# EAGLE design pc2_key (EAGLE 6.4)
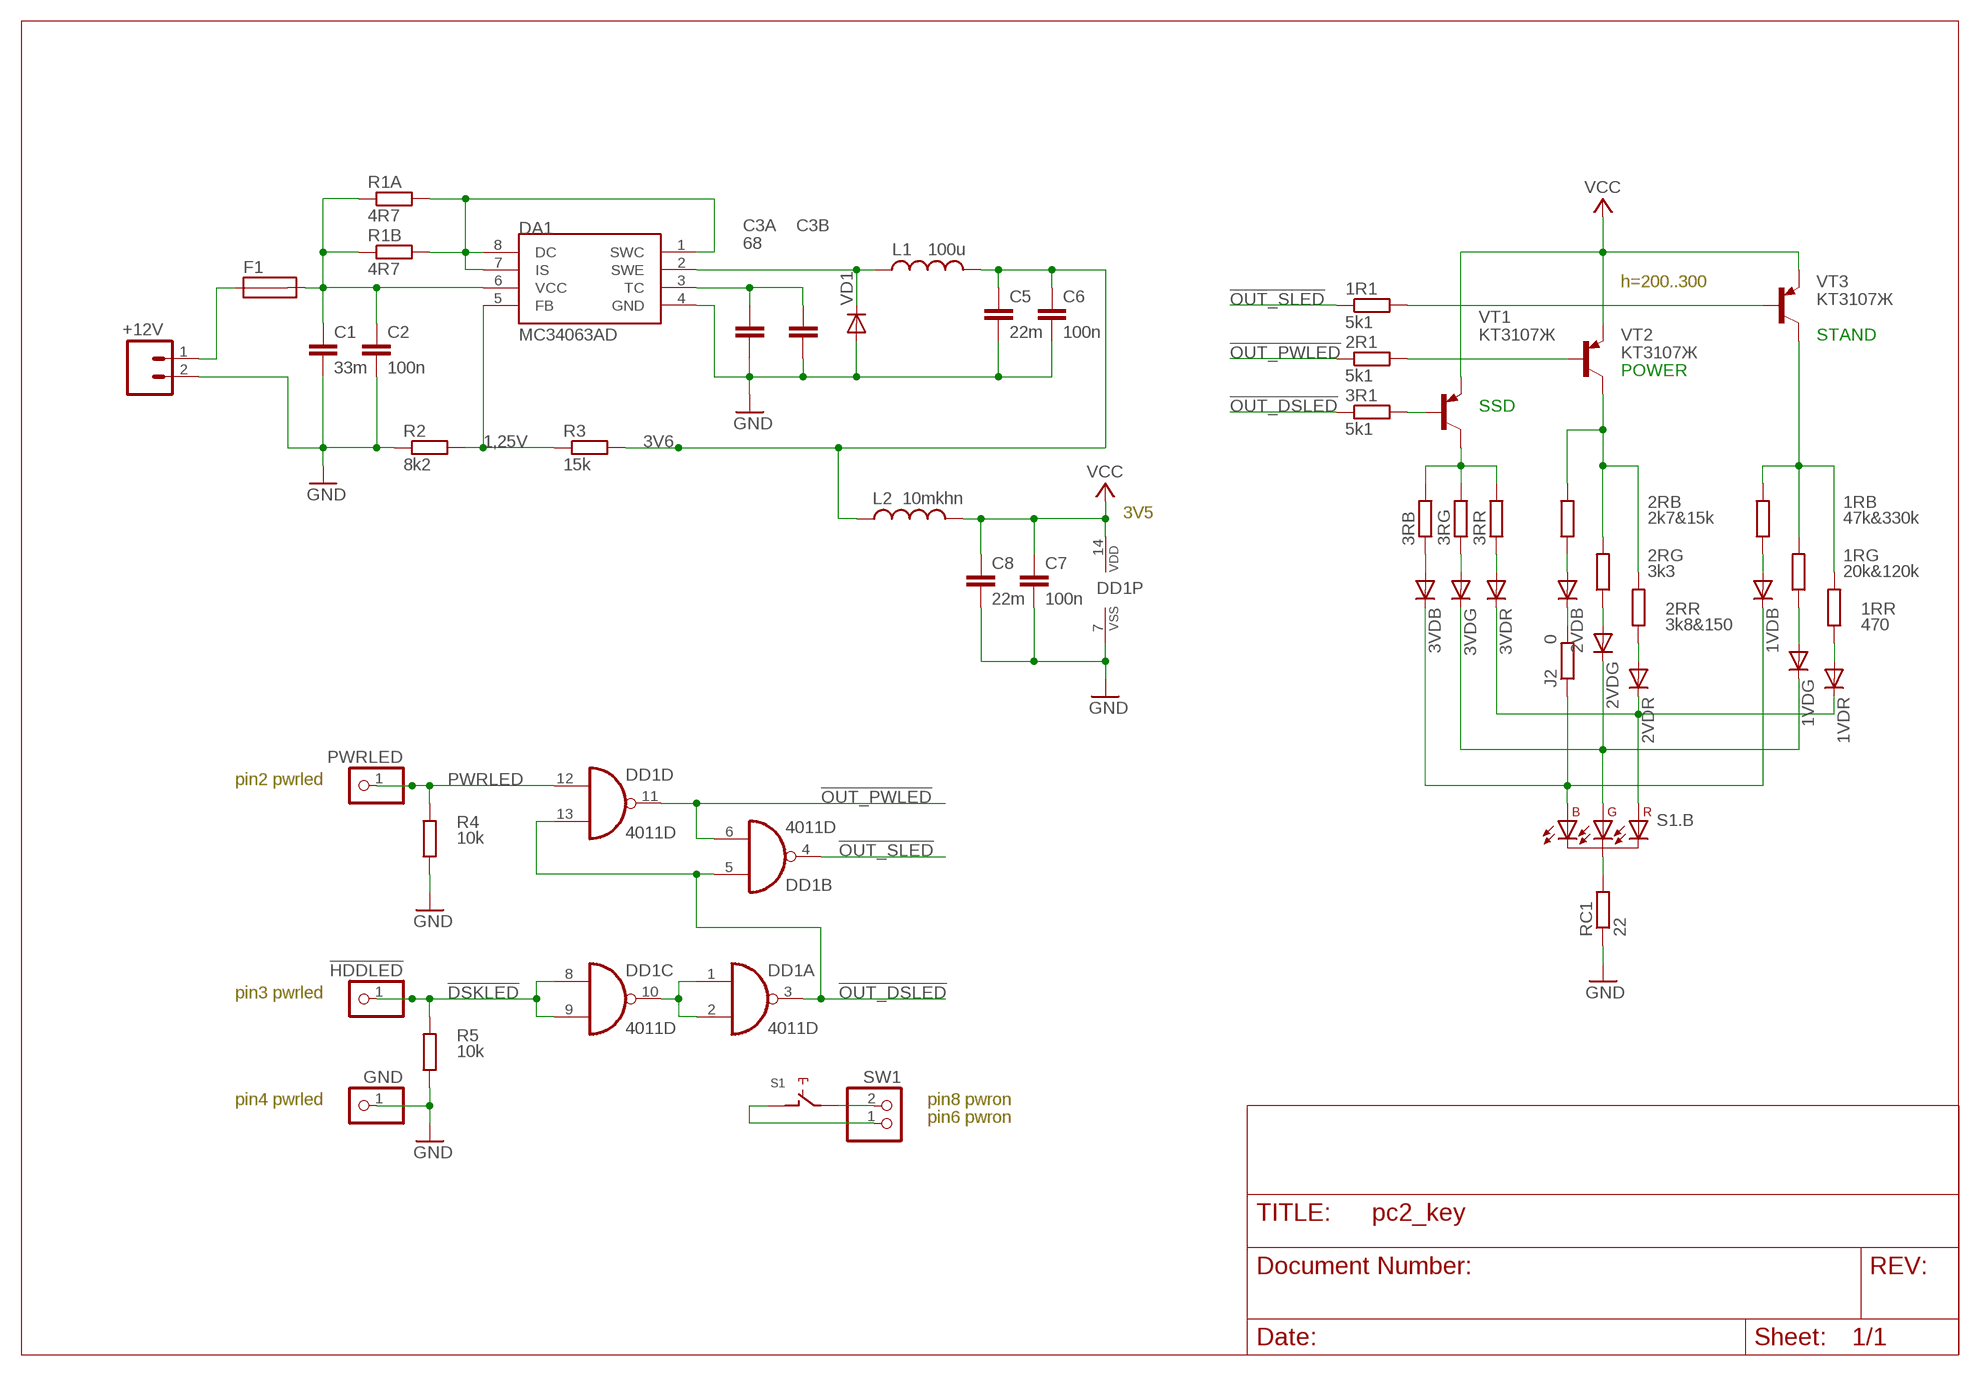
[diagram p0: schematic, sheet 1]

## Parts
1R1  5k1  R-EU_R1206W  [R1206W]
1RB  47k&330k  R-EU_R0805  [R0805]
1RG  20k&120k  R-EU_R0805  [R0805]
1RR  470  R-EU_R0805  [R0805]
1VDB  DIODE-SOD80C  [SOD80C]
1VDG  DIODE-SOD80C  [SOD80C]
1VDR  DIODE-SOD80C  [SOD80C]
2R1  5k1  R-EU_R1206W  [R1206W]
2RB  2k7&15k  R-EU_R0805  [R0805]
2RG  3k3  R-EU_R0805  [R0805]
2RR  3k8&150  R-EU_R0805  [R0805]
2VDB  DIODE-SOD80C  [SOD80C]
2VDG  DIODE-SOD80C  [SOD80C]
2VDR  DIODE-SOD80C  [SOD80C]
3R1  5k1  R-EU_R1206W  [R1206W]
3RB  R-EU_R0805  [R0805]
3RG  R-EU_R0805  [R0805]
3RR  R-EU_R0805  [R0805]
3VDB  DIODE-SOD80C  [SOD80C]
3VDG  DIODE-SOD80C  [SOD80C]
3VDR  DIODE-SOD80C  [SOD80C]
!HDDLED  PINHD-1X1  [1X01]
+12V  CON_2P  [CON_PWR_2PIN4MM]
C1  33m  C-EUC1210  [C1210]
C2  100n  C-EUC0805K  [C0805K]
C3A  68  C-EUC0805K  [C0805K]
C3B  C-EUC0805K  [C0805K]
C5  22m  C-EUC1210  [C1210]
C6  100n  C-EUC0805K  [C0805K]
C7  100n  C-EUC0805K  [C0805K]
C8  22m  C-EUC1210  [C1210]
DA1  MC34063AD  [SOIC8]
DD1  4011D  [SO14]
F1  SH32  [SH32]
GND  PINHD-1X1  [1X01]
J2  0  R-EU_R1206W  [R1206W]
L1  100u  L_LH7X10MM  [LH7X10MM]
L2  10mkhn  L-USPIS2816  [PIS2816]
PWRLED  PINHD-1X1  [1X01]
R1A  4R7  R-EU_R1206  [R1206]
R1B  4R7  R-EU_R1206  [R1206]
R2  8k2  R-EU_R0805  [R0805]
R3  15k  R-EU_R0805  [R0805]
R4  10k  R-EU_M0805  [M0805]
R5  10k  R-EU_R1206W  [R1206W]
RC1  22  R-EU_R0805  [R0805]
S1  CHERRY-MX  [CHERRY-MX-4P]
SW1  PINHD-1X2  [1X02]
VD1  DIODE-SMB  [SMB]
VT1  KT3107Ж  BJT_PNP_TO-92_EBC  [TO92]
VT2  KT3107Ж  BJT_PNP_TO-92_EBC  [TO92]
VT3  KT3107Ж  BJT_PNP_TO-92_EBC  [TO92]

## Nets
1,25V: DA1.5(FB) R2.2 R3.1
3V6: C5.1 C6.1 L1.1 L2.1 R3.2
!DSKLED: !HDDLED.1 DD1.8(C:I0) DD1.9(C:I1) R5.2
!OUT_DSLED: 3R1.1 DD1.3(A:O) DD1.5(B:I0) DD1.13(D:I1)
!OUT_PWLED: 2R1.1 DD1.6(B:I1) DD1.11(D:O)
!OUT_SLED: 1R1.1 DD1.4(B:O)
B: 1VDB.C 3VDB.C J2.1 S1.D1(.B:B)
G: 1VDG.C 2VDG.C 3VDG.C S1.D2(.B:G)
GND: +12V.2 C1.2 C2.2 C3A.2 C3B.2 C5.2 C6.2 C7.2 C8.2 DA1.4(GND) DD1.7(P:VSS) GND.1 R2.1 R4.1 R5.1 RC1.1 VD1.A
N$3: DA1.1(SWC) DA1.7(IS) DA1.8(DC) R1A.2 R1B.2
N$5: C3A.1 C3B.1 DA1.3(TC)
N$6: 1RR.1 1VDR.A
N$7: 1RG.1 1VDG.A
N$8: 1RB.1 1VDB.A
N$9: 3R1.2 VT1.2(B)
N$10: 2R1.2 VT2.2(B)
N$11: 2RB.1 2VDB.A
N$12: 1R1.2 VT3.2(B)
N$15: 2RR.1 2VDR.A
N$16: 2RG.1 2VDG.A
N$17: 3RR.1 3VDR.A
N$18: 3RG.1 3VDG.A
N$19: DA1.2(SWE) L1.2 VD1.C
N$20: 3RB.1 3VDB.A
N$21: S1.SW2(.A:SW2) SW1.1
N$22: S1.SW1(.A:SW1) SW1.2
N$23: RC1.2 S1.D3(.B:RGB-)
N$24: 2VDB.C J2.2
N$26: 3RB.2 3RG.2 3RR.2 VT1.3(C)
N$27: 2RB.2 2RG.2 2RR.2 VT2.3(C)
N$28: 1RB.2 1RG.2 1RR.2 VT3.3(C)
N$29: DD1.1(A:I0) DD1.2(A:I1) DD1.10(C:O)
N$30: C1.1 C2.1 DA1.6(VCC) F1.P$2(2A) R1A.1 R1B.1
N$33: +12V.1 F1.P$1(1A)
PWRLED: DD1.12(D:I0) PWRLED.1 R4.2
R: 1VDR.C 2VDR.C 3VDR.C S1.D4(.B:R)
VCC: C7.1 C8.1 DD1.14(P:VDD) L2.2 VT1.1(E) VT2.1(E) VT3.1(E)

## Notes on the sheet
- h=200..300
- STAND
- POWER
- SSD
- 3V5
- pin2 pwrled
- pin3 pwrled
- pin4 pwrled | pin8 pwron
- pin6 pwron

## Library data of the parts
1R1 1RB 1RG 1RR 2R1 2RB 2RG 2RR 3R1 3RB 3RG 3RR J2 R4 R5 RC1 = rcl:R-EU_: RESISTOR, European symbol
1VDB 1VDG 1VDR 2VDB 2VDG 2VDR 3VDB 3VDG 3VDR VD1 = diode:DIODE-: DIODE
!HDDLED GND PWRLED = pinhead:PINHD-1X1: PIN HEADER
+12V = DSS:CON_2P
C1 C5 C8 = rcl:C-EU: CAPACITOR, European symbol
C2 C3A C3B C6 C7 = resistor:C-EU: CAPACITOR, European symbol
DA1 = mc34063:MC34063
DD1 = 40xx:4011: Quad 2-input NAND
F1 = fuse:SH32: FUSE HOLDER 6 x 32 mm, SH contact, SHH3N Schukat, 102071 Wickmann (Buerklin); MPN: 10207101009; OC_FARNELL: 811786; OC_NEWARK: 76R6904
L1 = ct-pack:L_: INDUCTOR, American symbol
L2 = rcl:L-US: INDUCTOR, American symbol
R1A R1B R2 R3 = resistor:R-EU_: RESISTOR, European symbol
S1 = gateronrgb:CHERRY-MX: Cherry MX series keyswitch
SW1 = pinhead:PINHD-1X2: PIN HEADER
VT1-VT3 = m_transistor:BJT_PNP: PNP Transistror КТ3107* CBE BD138 ECB

## Board
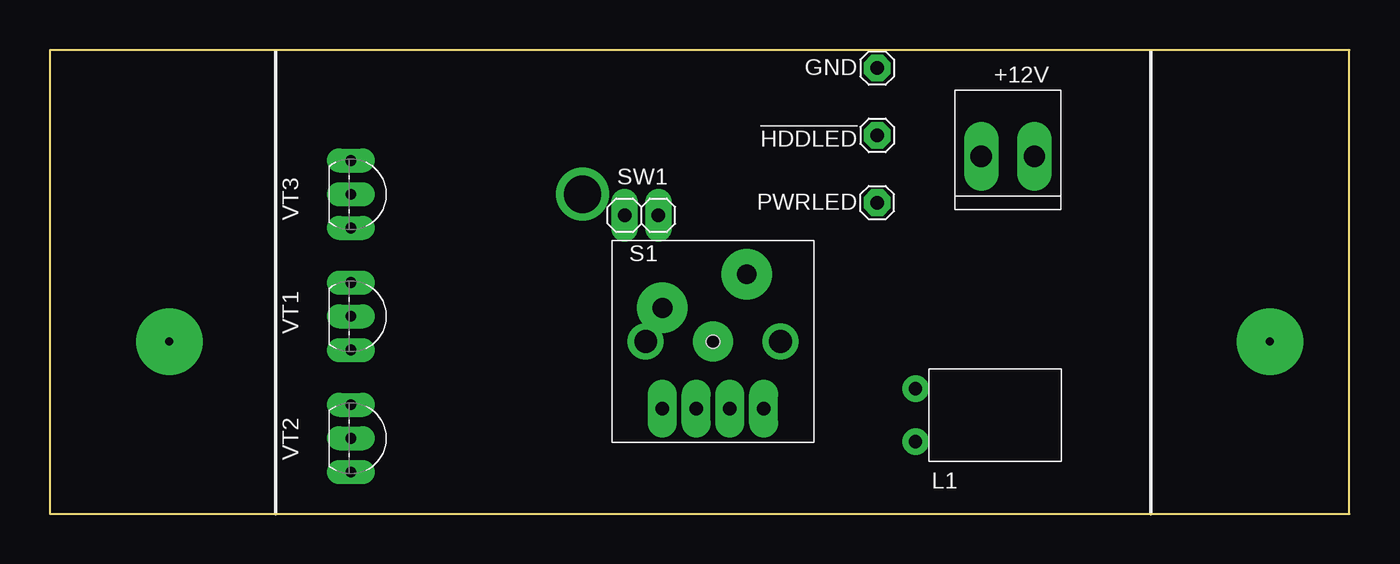
[diagram p1: board, top side]
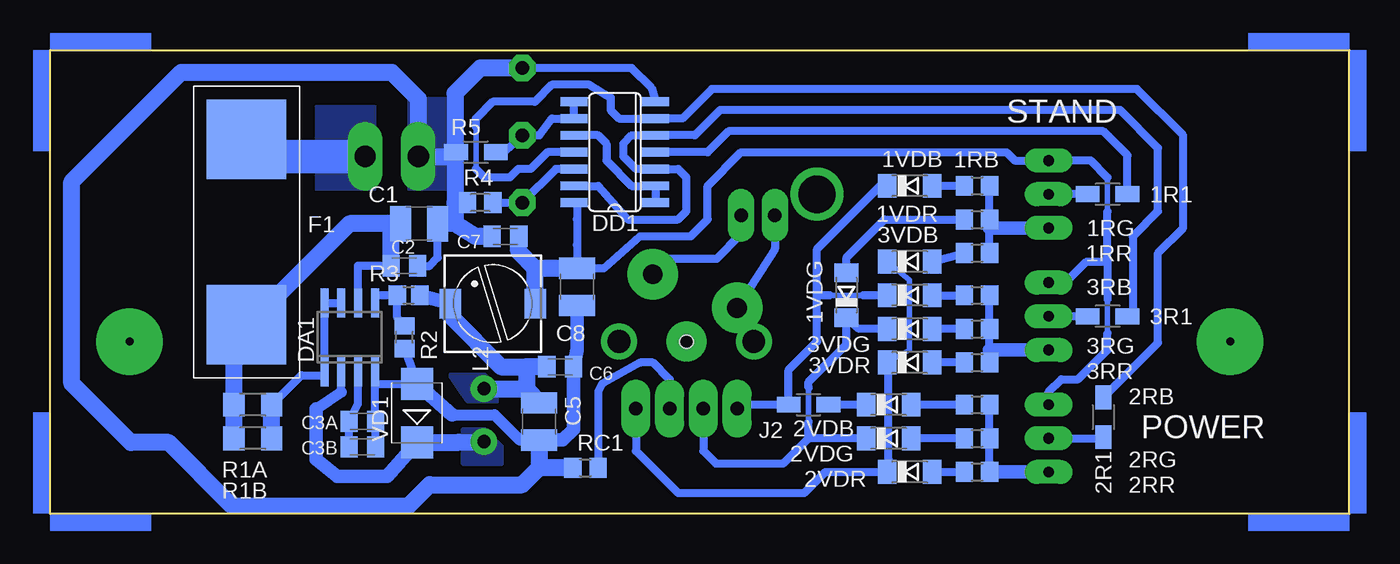
[diagram p2: board, bottom side, seen from below]

Size 98 x 35 mm. Coordinates in mm from the lower left corner, seen from the top.
Outline: 98,35 0,35 0,0 98,0 98,35
Copper layers (1*16): Top 0.035mm / dielectric 1.5mm / Bottom 0.035mm
Design rules "DesignRules": minimum track width 8mil, minimum drill 24mil, track to track 0.2mm, track to pad 0.2mm, pad to pad 8mil, via to via 8mil, smd to smd 8mil, copper to edge 10mil, drill to drill 8mil, minimum pad ring 0.5mm, minimum via ring 8mil, stop-mask expansion 4mil, vias tented up to drill 0mil, thermal gap 10mil

### Footprints (pad centres in the part's own frame; a part is rotated, then mirrored left to right if it is on the bottom)
R1206W = smd 1.8 x 1.2: 1 -1.499,0; 2 1.499,0
R0805 = smd 1.3 x 1.5: 1 -0.95,0; 2 0.95,0
SOD80C = smd 1.4 x 1.8: A 1.7,0; C -1.7,0
1X01 = drill 1.016 octagon: 1 0,0
CON_PWR_2PIN4MM = drill 1.6 long: 1 -2,0; 2 2,0
C1210 = smd 1.6 x 2.7: 1 -1.4,0; 2 1.4,0
C0805K = smd 1.3 x 1.6: 1 -1,0; 2 1,0
SOIC8 = smd 0.6 x 2.2: 1 -1.905,-2.6; 2 -0.635,-2.6; 3 0.635,-2.6; 4 1.905,-2.6; 5 1.905,2.6; 6 0.635,2.6; 7 -0.635,2.6; 8 -1.905,2.6
SO14 = smd 0.66 x 2.032: 1 -3.81,-3.073; 2 -2.54,-3.073; 3 -1.27,-3.073; 4 0,-3.073; 5 1.27,-3.073; 6 2.54,-3.073; 7 3.81,-3.073; 8 3.81,3.073; 9 2.54,3.073; 10 1.27,3.073; 11 0,3.073; 12 -1.27,3.073; 13 -2.54,3.073; 14 -3.81,3.073
SH32 = smd 6 x 6: P$1 -7,0; P$2 7,0
LH7X10MM = drill 1: 1 -2,-6; 2 2,-6
PIS2816 = smd 2.2 x 1.6: 1 0,3.2; 2 0,-3.2
R1206 = smd 1.6 x 1.803: 1 -1.422,0; 2 1.422,0
R0805' = smd 1.3 x 1.5: 1 -0.85,0; 2 0.85,0
M0805 = smd 1.3 x 1.6: 1 -0.95,0; 2 0.95,0
CHERRY-MX-4P = drill 1.016 pad 2.184 long: D1 -3.81,-5.08; D2 -1.27,-5.08; D3 1.27,-5.08; D4 3.81,-5.08 | drill 1 pad 3: P$1 0,0 | drill 1.714 pad 1.93: P$3 -5.08,0; P$4 5.08,0 | drill 1.5 pad 3.81: SW1 -3.81,2.54; SW2 2.54,5.08 | hole 1: 0,0
1X02 = drill 1.016 long: 1 -1.27,0; 2 1.27,0
SMB = smd 2.4 x 2.4: A 2.2,0; C -2.2,0
TO92 = drill 0.813 long: 1 -2.54,-1.27; 2 0,-1.27; 3 2.54,-1.27

### Placement (x,y rotation side)
1R1  18.25,24.11 180 bottom
1RB  28.09,24.75 0 bottom
1RG  28.09,22.21 0 bottom
1RR  28.09,19.67 0 bottom
1VDB  33.17,24.75 0 bottom
1VDG  37.94,16.49 90 bottom
1VDR  33.17,19.03 0 bottom
2R1  18.57,7.29 270 bottom
2RB  28.09,8.24 0 bottom
2RG  28.09,5.7 0 bottom
2RR  28.09,3.16 0 bottom
2VDB  34.76,8.24 0 bottom
2VDG  34.76,5.7 0 bottom
2VDR  33.17,3.16 0 bottom
3R1  18.25,14.9 180 bottom
3RB  9k1&200k  [R0805]  28.09,16.49 0 bottom
3RG  20k&27k  [R0805]  28.09,13.95 0 bottom
3RR  1k&1k  [R0805]  28.09,11.41 0 bottom
3VDB  33.17,16.49 0 bottom
3VDG  33.17,13.95 0 bottom
3VDR  33.17,11.41 0 bottom
!HDDLED  62.38,28.56 0 top
+12V  72.22,26.97 180 top
C1  70.16,21.89 0 bottom
C2  71.27,18.71 0 bottom
C3A  74.45,6.97 0 bottom
C3B  74.45,5.06 0 bottom
C5  61.11,6.97 270 bottom
C6  59.52,11.1 0 bottom
C7  63.65,20.94 180 bottom
C8  58.26,17.13 270 bottom
DA1  75.4,13.32 0 bottom
DD1  55.4,27.29 90 bottom
F1  83.18,21.26 270 bottom
GND  62.38,33.64 0 top
J2  40.79,8.24 0 bottom
L1  71.27,7.44 270 top
L2  64.61,15.86 90 bottom
PWRLED  62.38,23.48 180 top
R1A  82.7,8.24 0 bottom
R1B  82.7,5.7 0 bottom
R2  8k2  [R0805']  71.27,13.32 90 bottom
R3  15k  [R0805']  70.95,16.49 0 bottom
R4  65.56,23.48 0 bottom
R5  65.88,27.29 0 bottom
RC1  57.62,3.47 0 bottom
S1  50,13 0 top
SW1  44.6,22.52 180 top
U$5  [ANGLE-SW-1]  0,0 0 top
U$6  [ANGLE-SW-1]  0,35 270 top
U$7  [ANGLE-SW-1]  98,35 180 top
U$8  [ANGLE-SW-1]  98,0 90 top
VD1  70.32,7.6 90 bottom
VT1  23.96,14.9 270 top
VT2  23.96,5.7 270 top
VT3  23.96,24.11 270 top

### Tracks (layer width: path | path; a pad name or v marks a point on that pad's centre or on a via)
1,25V
  Bottom 0.61: R2.2 71.81,14.8 R3.1 73.5,16.49 DA1.5
3V6
  Bottom 1.016: R3.2 L2.1
  Bottom 1.27: C6.1 62.06,11.1 | 62.06,11.1 62.06,9.44 | L2.1 67.81,14.93 63.97,11.1 62.06,11.1 | L1.1 62.06,9.44 | 62.06,9.44 C5.1
  pour Bottom (no thermals): 64.29,8.55 66.51,8.55 67.78,10.46 65.24,10.46
!DSKLED
  Bottom 0.61: DD1.8 DD1.9 60.16,29.83 61.11,28.56 !HDDLED.1 63.74,27.29 R5.2
!OUT_DSLED
  Bottom 0.61: DD1.13 56.67,24.75 54.45,22.21 50.63,22.21 50,22.84 50,25.38 50.63,26.02 DD1.3 53.81,26.02 54.76,26.97 54.76,27.92 54.13,28.56 DD1.5 49.37,28.56 47.46,30.46 17.3,30.46 14.44,27.61 14.44,22.84 16.34,20.94 16.34,15.31 3R1.1
!OUT_PWLED
  Bottom 0.406: 65.88,26.02 65.88,29.19
  Bottom 0.61: 2R1.1 14.44,12.91 14.44,19.67 12.53,21.57 12.53,28.56 16.03,32.05 48.09,32.05 50.32,29.83 DD1.6 55.08,29.83 55.72,30.46 55.72,31.41 57.3,32.37 60.16,32.37 61.43,31.1 64.61,31.1 65.88,29.83 65.88,29.19 | DD1.11 60.48,27.29 61.75,26.02 62.7,26.02 63.34,25.38 65.24,25.38 65.88,26.02
!OUT_SLED
  Bottom 0.61: 1R1.1 16.75,27.06 18.57,28.88 46.83,28.88 48.41,27.29 DD1.4
B
  Bottom 0.406: 36.66,16.49 39.2,16.49
  Bottom 0.61: 40.16,16.49 40.16,19.98 35.39,24.75 1VDB.C | 3VDB.C 36.66,16.49 | 39.2,16.49 40.16,16.49 | 40.16,16.49 40.16,13 42.29,10.87 J2.1 45.87,8.24 S1.D1
G
  Bottom 0.406: 40.79,6.97 40.79,9.51
  Bottom 0.61: 3VDG.C 36.98,13.95 1VDG.C 37.94,12.79 40.79,9.94 40.79,9.51 | 2VDG.C 40.79,5.7 | 40.79,5.7 40.79,6.97 | S1.D2 48.73,4.74 47.78,3.79 42.7,3.79 40.79,5.7
GND
  Bottom 0.406: C3A.2 73.5,7.33
  Bottom 0.61: C3B.2 C3A.2 | 73.5,7.33 DA1.4 73.5,9.8 VD1.A R2.1 | DD1.7 52.64,32.15 54.13,33.64 GND.1 | C2.2 69.37,18.71 68.76,19.32 C1.2 | R5.1 67.46,27.29 | R4.1 67.46,23.48 | 58.23,15.7 C8.2
  Bottom 0.813: 67.67,7.47 64.47,7.47 62.57,5.57 C5.2
  Bottom 1.016: 67.67,7.47 VD1.A | C8.2 58.26,12.37 C6.2 58.52,6.38 59.34,5.57 C5.2
  Bottom 1.27: 67.46,26.97 +12V.2 70.22,31.32 72.22,33.32 88.1,33.32 96.35,25.06 96.35,9.82 91.91,5.38 89.05,5.38 84.29,0.62 70.95,0.62 69.37,2.21 62.38,2.21 61.11,3.47 | 67.46,26.97 67.46,23.48 67.46,21.89 | 67.46,21.89 C1.2 | C7.2 65.92,20.94 67.46,21.89 | 67.46,26.97 67.46,27.29 67.46,31.73 65.56,33.64 GND.1 | C5.2 61.11,3.47 | RC1.1 61.11,3.47
  pour Bottom (no thermals): 67.78,24.43 70.95,24.43 70.95,31.41 67.78,31.41
N$1  (via drill 0.6 pad 5)
  other vias: 9,13
N$2  (via drill 0.6 pad 5)
  other vias: 92,13
N$3
  Bottom 0.61: DA1.1 DA1.8 DA1.7 | 77.31,10.78 DA1.1 | R1A.2 79.06,10.46 77.31,10.46 DA1.1
  Bottom 1.27: R1B.2 R1A.2
N$5
  Bottom 0.61: C3B.1 C3A.1 74.77,8.29 DA1.3
N$6
  Bottom 0.61: 1VDR.A 1RR.1
N$7
  Bottom 0.61: 1VDG.A 37.94,19.35 35.08,22.21 1RG.1
N$8
  Bottom 0.61: 1RB.1 1VDB.A
N$9
  Bottom 0.61: 3R1.2 VT1.2
N$10
  Bottom 0.61: VT2.2 18.66,5.7 2R1.2
N$11
  Bottom 0.61: 2RB.1 2VDB.A
N$12
  Bottom 0.61: 1R1.2 VT3.2
N$15
  Bottom 0.61: 2VDR.A 2RR.1
N$16
  Bottom 0.61: 2RG.1 2VDG.A
N$17
  Bottom 0.61: 3RR.1 3VDR.A
N$18
  Bottom 0.61: 3RG.1 3VDG.A
N$19
  Bottom 0.61: 76.03,9.19 DA1.2
  Bottom 0.813: 77.94,7.92 76.03,9.19
  Bottom 1.016: 77.94,7.92 77.94,4.11 76.35,2.84 72.56,2.84 VD1.C
  Bottom 1.27: VD1.C 67.16,5.4 L1.2
  pour Bottom (no thermals): 65.24,6.33 66.83,6.33 66.83,3.79 63.97,3.79 63.97,5.06
N$20
  Bottom 0.61: 3VDB.A 3RB.1
N$21
  Bottom 0.61: S1.SW2 51.38,19.24 47.73,19.24 45.87,21.1 SW1.1
N$22
  Bottom 0.61: SW1.2 43.33,19.98 S1.SW1
N$23
  Bottom 0.61: S1.D3 51.27,10.14 52.54,11.41 53.49,11.41 56.35,9.82 56.67,9.19 56.67,6.97 RC1.2
N$24
  Bottom 0.61: 2VDB.C J2.2
N$26
  Bottom 0.61: 3RR.2 27.14,12.37 3RG.2 3RB.2
  Bottom 1.016: VT1.3 27.14,12.37
N$27
  Bottom 0.61: 2RR.2 2RG.2 2RB.2
  Bottom 1.016: VT2.3 2RR.2
N$28
  Bottom 0.61: 1RR.2 27.14,21.57 1RG.2 1RB.2
  Bottom 1.016: VT3.3 27.14,21.57
N$29
  Bottom 0.61: DD1.1 DD1.2 54.13,24.75 56.03,26.65 56.03,27.92 56.67,28.56 DD1.10
N$30
  Bottom 0.61: DA1.6 74.77,18.71 C2.1
  Bottom 1.27: C1.1 72.22,21.89 | 72.22,21.89 75.4,21.89 81.11,16.18 81.11,15.05 F1.P$2 84.12,13.31 R1A.1 R1B.1 | C2.1 72.27,21.84 72.22,21.89
N$31  (via drill 2.8 pad 4)
  other vias: 40.16,24.11
N$33
  Bottom 2.54: F1.P$1 83.16,26.97 +12V.1
  pour Bottom (no thermals): 73.5,30.78 73.5,24.43 77.94,24.43 77.94,30.78
PWRLED
  Bottom 0.61: DD1.12 59.84,26.02 PWRLED.1 R4.2
R
  Bottom 0.406: 3VDR.C 33.17,12.37 33.17,17.65 1VDR.C
  Bottom 0.61: 3VDR.C 34.76,11.1 34.76,4.11 2VDR.C 39.52,3.16 41.11,1.57 50.63,1.57 53.81,4.74 S1.D4
VCC
  Bottom 0.406: 18.25,13.63 18.25,16.18 | 18.25,22.84 18.25,25.38
  Bottom 0.61: DD1.14 58.26,23.48 58.26,22.21 58.26,20.3 C8.1 56.22,18.53 53.49,20.94 49.68,20.94 48.41,22.21 48.41,24.75 45.87,27.29 25.87,27.29 25.23,26.65 VT3.1 19.52,26.65 18.25,25.38 | 18.25,13.63 18.25,12.37 20.47,10.14 21.74,10.14 22.7,9.19 VT2.1 | 18.25,19.03 18.25,16.18 | VT1.1 21.43,17.45 19.84,19.03 18.25,19.03 | 18.25,19.03 18.25,22.84
  Bottom 1.27: C8.1 61.43,18.53 | 61.43,18.53 62.65,19.8 C7.1 | L2.2 61.43,15.86 61.43,18.53

### Text on the board
bPlace: STAND | POWER